# Altium schematic sheet pinheader.SchDoc
size A
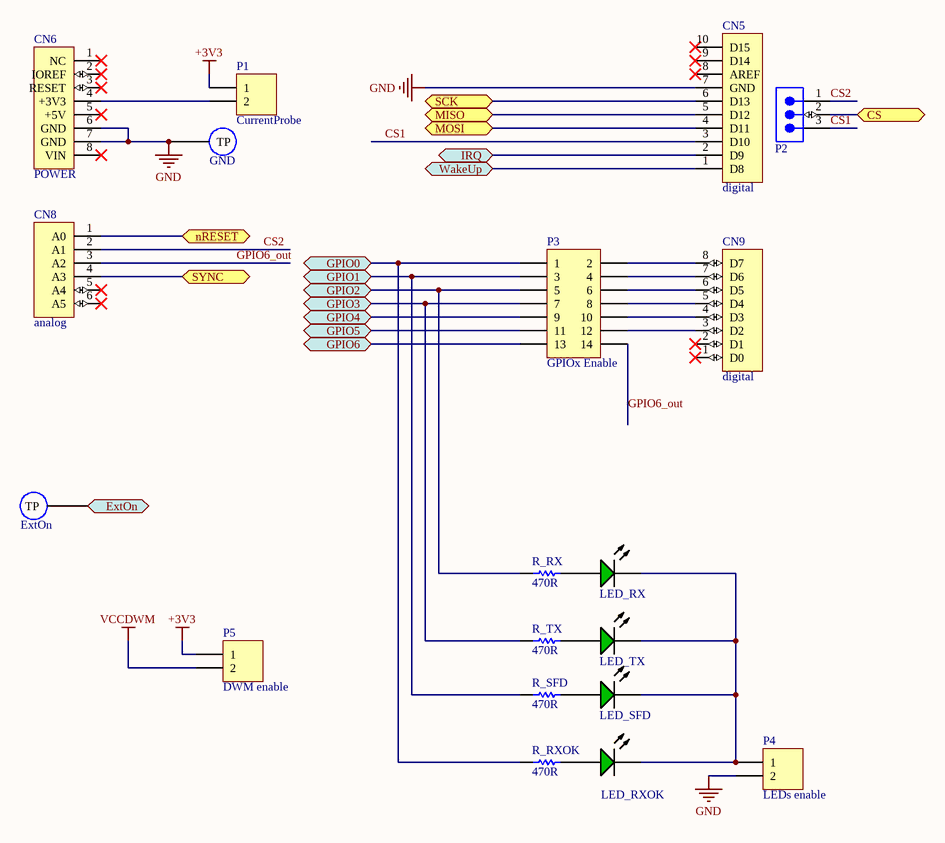
[diagram p0: pinheader.SchDoc]

## Parts
CN5  digital  [HDR1X10]
CN6  POWER  [HDR1X8]
CN8  analog  [HDR1X6]
CN9  digital  [HDR1X8]
ExtOn  Component_1  [KSTN-5000]  (value not drawn)
GND  Component_1  [KSTN-5000]  (value not drawn)
LED_RX  APG1608CGKC/T  [KING-LED0603-25-GREEN_V]  (value not drawn)
LED_RXOK  APG1608CGKC/T  [KING-LED0603-25-GREEN_V]  (value not drawn)
LED_SFD  APG1608CGKC/T  [KING-LED0603-25-GREEN_V]  (value not drawn)
LED_TX  APG1608CGKC/T  [KING-LED0603-25-GREEN_V]  (value not drawn)
P1  CurrentProbe  [HDR1X2H]
P2  Through-hole  [SMTC-MTSW-103-08-X-S-229-RA]  (value not drawn)
P3  GPIOx Enable  [HDR2X7]
P4  LEDs enable  [HDR1X2]
P5  DWM enable  [HDR1X2]
R_RX  470R  [RESC0603(1608)_L]
R_RXOK  470R  [RESC0603(1608)_L]
R_SFD  470R  [RESC0603(1608)_L]
R_TX  470R  [RESC0603(1608)_L]

## Ports
CS (bidir), ExtOn (bidir), GPIO0 (bidir), GPIO1 (bidir), GPIO2 (bidir), GPIO3 (bidir), GPIO4 (bidir), GPIO5 (bidir), GPIO6 (bidir), IRQ (bidir), MISO (bidir), MOSI (bidir), nRESET (bidir), SCK (bidir), SYNC (bidir), WakeUp (bidir)

## Nets
+3V3: P1.1 P5.1
GND: CN5.7(GND) CN6.6(GND) CN6.7(GND) GND.1(TP) P4.2
VCCDWM: P5.2
CS: P2.2 ; port CS
CS1: CN5.3(D10) P2.3
CS2: CN8.2(A1) P2.1
ExtOn: ExtOn.1(TP) ; port ExtOn
GPIO0: P3.1 R_RXOK.1 ; port GPIO0
GPIO1: P3.3 R_SFD.1 ; port GPIO1
GPIO2: P3.5 R_RX.1 ; port GPIO2
GPIO3: P3.7 R_TX.1 ; port GPIO3
GPIO4: P3.9 ; port GPIO4
GPIO5: P3.11 ; port GPIO5
GPIO6: P3.13 ; port GPIO6
GPIO6_out: CN8.3(A2) P3.14
IRQ: CN5.2(D9) ; port IRQ
MISO: CN5.5(D12) ; port MISO
MOSI: CN5.4(D11) ; port MOSI
nRESET: CN8.1(A0) ; port nRESET
SCK: CN5.6(D13) ; port SCK
SYNC: CN8.4(A3) ; port SYNC
WakeUp: CN5.1(D8) ; port WakeUp
NetCN6_4: CN6.4(+3V3) P1.2
NetCN9_3: CN9.3(D2) P3.12
NetCN9_4: CN9.4(D3) P3.10
NetCN9_5: CN9.5(D4) P3.8
NetCN9_6: CN9.6(D5) P3.6
NetCN9_7: CN9.7(D6) P3.4
NetCN9_8: CN9.8(D7) P3.2
NetLED_RX_1: LED_RX.1(A) R_RX.2
NetLED_RX_2: LED_RX.2(K) LED_RXOK.2(K) LED_SFD.2(K) LED_TX.2(K) P4.1
NetLED_RXOK_1: LED_RXOK.1(A) R_RXOK.2
NetLED_SFD_1: LED_SFD.1(A) R_SFD.2
NetLED_TX_1: LED_TX.1(A) R_TX.2

Not connected (* = marked no-connect by the designer): CN5 8(AREF)* 9(D14)* 10(D15)*; CN6 1(NC)* 2(IOREF)* 3(RESET)* 5(+5V)* 8(VIN)*; CN8 5(A4)* 6(A5)*; CN9 1(D0)* 2(D1)*

## Library data of the parts
CN5 = Header 10: Header, 10-Pin; LatestRevisionDate: 17-Jul-2002; LatestRevisionNote: Re-released for DXP Platform.; Publisher: Altium Limited
CN6 CN9 = Header 8: Header, 8-Pin; LatestRevisionDate: 17-Jul-2002; LatestRevisionNote: Re-released for DXP Platform.; Publisher: Altium Limited
CN8 = Header 6: Header, 6-Pin; LatestRevisionDate: 17-Jul-2002; LatestRevisionNote: Re-released for DXP Platform.; Publisher: Altium Limited
ExtOn GND = Component_1: test point
LED_RX LED_RXOK LED_SFD LED_TX = CMP-0239-00001-1: LED, SMT, 0603(1608), 0.25mm Thickness, Green; Forward Current: 30 mA; Reverse Voltage: 5 V; Power Dissipation: 78 mW; Packing: Reel; ComponentLink1Description: Manufacturer URL; ComponentLink1URL: http://www.kingbrightusa.com/; ComponentLink2URL: http://www.kingbrightusa.com/images/catalog/SPEC/APG1608CGKC-T.pdf; Mounting Technology: Surface Mount; Storage Temperature: -40 to 85 degC; DatasheetVersion: Rev. 5B, 10/2012; PartNumber: APG1608CGKC/T; PackageReference: LED0603-25-GREEN; ComponentLink2Description: Datasheet; PackageDescription: 2-Pin SMT LED, 1.6 x 0.8 mm Body, 0.25mm Thickness; PackageVersion: Rev. 5B, 10/2012
P1 = Header 2H: Header, 2-Pin, Right Angle; LatestRevisionDate: 17-Jul-2002; LatestRevisionNote: Re-released for DXP Platform.; Publisher: Altium Limited
P2 = CMP-1024-00100-1: Modified .025" SQ Post Header, Through-hole, Right Angle, -55 to 125 degC, 2.54 mm Pitch, 3-Pin, Male, RoHS; Manufacturer: Samtec; PartNumber: MTSW-103-08-G-S-229-RA; Pitch: 2.54 mm; ComponentLink1URL: http://www.samtec.com; ComponentLink3Description: Package Specification; Mounting Technology: Through-hole; PackageDescription: Assembly .025" [.64] SQ Post Terminal Strip; ComponentLink2URL: http://www.samtec.com/documents/webfiles/pdf/MTSW.PDF; PackageVersion: BI, 2/1987; ComponentLink1Description: Manufacturer URL; PackageReference: MTSW-103-08-X-S-229-RA; Orientation: Right Angle; DatasheetVersion: F-214; RoHS: True; Temperature Range: -55 to 125 degC; ComponentLink3URL: http://www.samtec.com/documents/webfiles/cpdf/MTSW-XXX-XX-X-X-XXXX-XX-XXX-MKT1.pdf; ComponentLink2Description: Datasheet
P3 = Header 7X2: Header, 7-Pin, Dual row; LatestRevisionDate: 17-Jul-2002; LatestRevisionNote: Re-released for DXP Platform.; Publisher: Altium Limited
P4 P5 = Header 2: Header, 2-Pin; LatestRevisionDate: 17-Jul-2002; LatestRevisionNote: Re-released for DXP Platform.; Publisher: Altium Limited
R_RX R_RXOK R_SFD R_TX = CMP-1012-00473-1: 470R 0.1W 1% 0603 (1608 Metric)  SMD; Value: 470.00 Ohm; Case-Metric: 1608; Case-EIA: 0603; Power: 0.1 W; Technology: SMT; Tolerance: 1 %